# Altium schematic sheet 2_P2.schdoc
size 307 x 218 mm; Symbol: Drawing-Symbol_A4; Device: Drawing-Symbol_A4; @Project Name: ESP32-C3 module_2024-02-14_10-07-03; @Page Count: 2; @Update Date: 2025-09-02; @Create Date: 2025-08-24; @Schematic Name: Schematic1; @Page No: 2; @Page Name: P2; Company: EasyEDA.com; Version: V1.0; Page Size: A4; Drawn: Paraskevas K.; @Create Time: 19:22:43; @Update Time: 13:49:49; Width: 1170; Height: 825; Region Start: 1; X Region Count: 6; Y Region Count: 4; Blade Width: 10; Title Block Position: 3; @Board Name: Sprig-C6
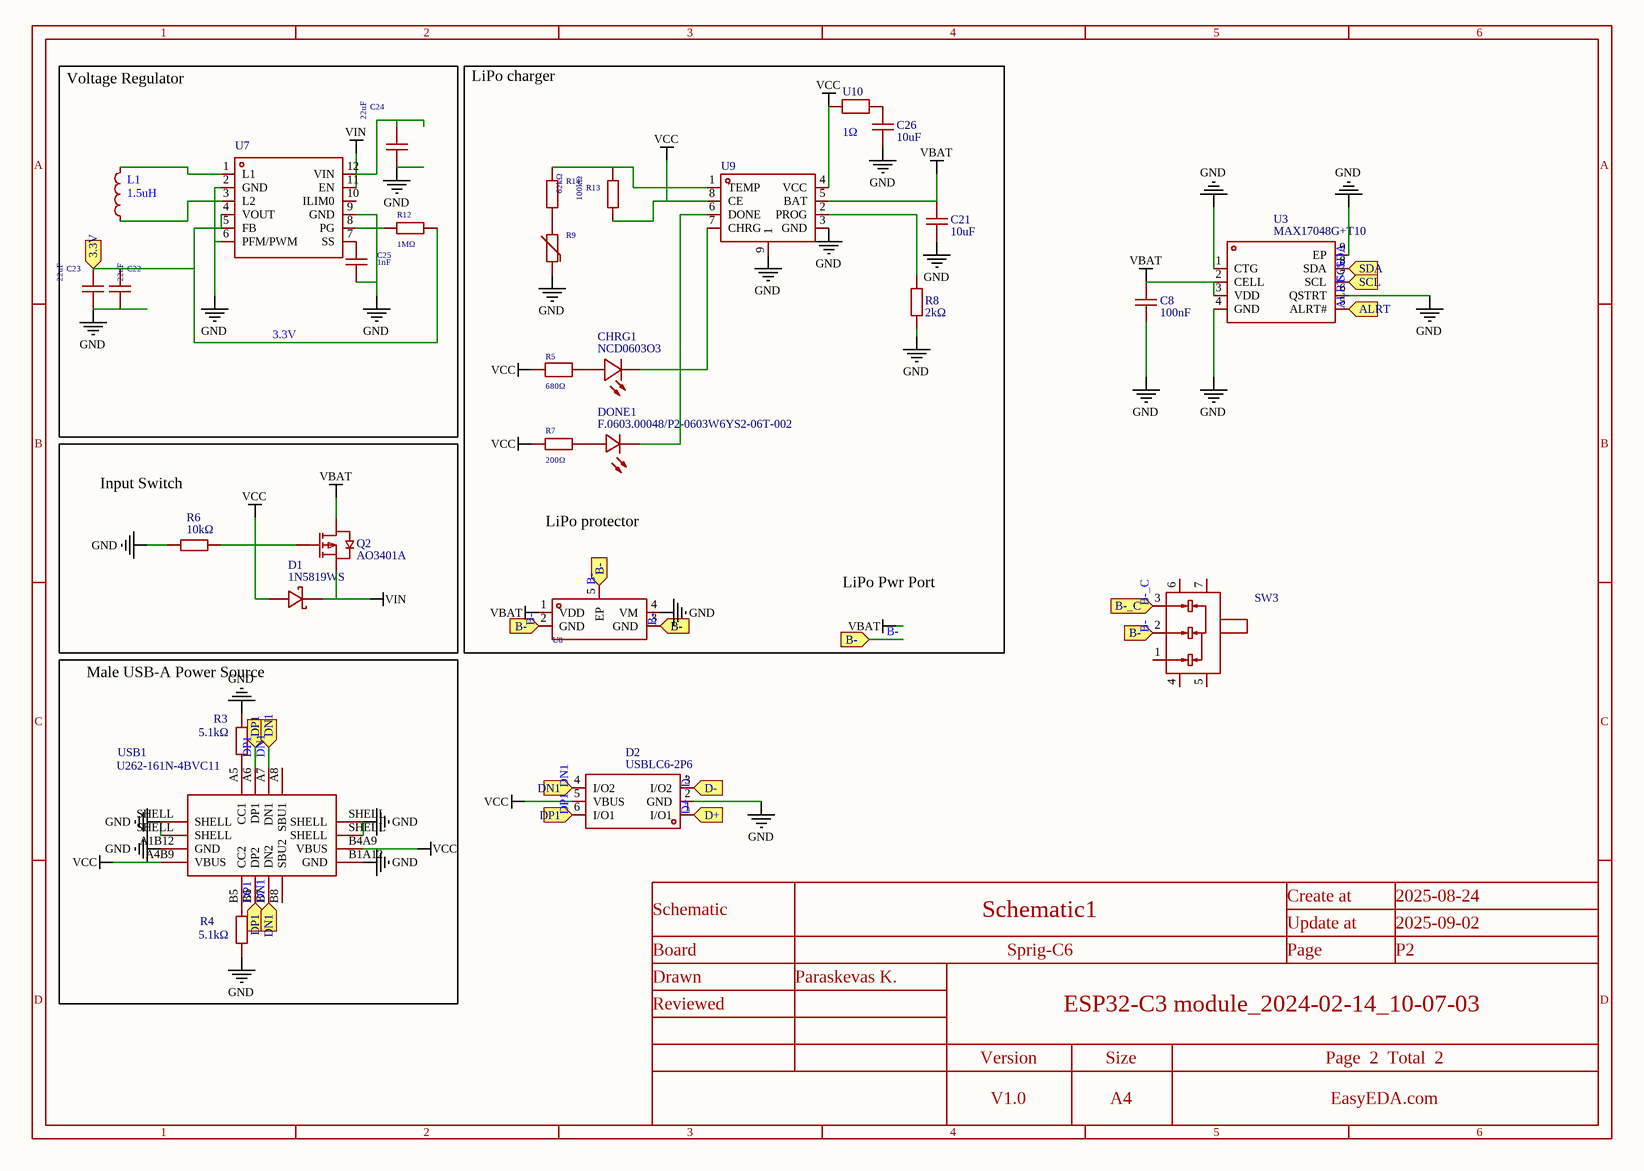
[diagram p0: 2_P2.schdoc]

## Parts
C8  100nF  [C0402]
C21  10uF  [C0402]
C22  22uF  [C0402]
C23  22uF  [C0402]
C24  22uF  [C0402]
C25  1nF  [C0402]
C26  10uF  [C0402]
CHRG1  NCD0603O3  [LED0603-RD]
D1  1N5819WS  [SOD-323_L1.8-W1.3-LS2.5-RD]
D2  USBLC6-2P6  [SOT-666-6_L1.6-W1.2-P0.50-LS1.6-BL]
DONE1  F.0603.00048/P2-0603W6YS2-06T-002  [LED-SMD_L1.6-W0.8-RD-WHITE-2]
L1  1.5uH  [L0806]
Q2  AO3401A  [SOT-23_L2.9-W1.3-P1.90-LS2.4-BR]
R3  5.1kΩ  [R0402]
R4  5.1kΩ  [R0402]
R5  680Ω  [R0402]
R6  10kΩ  [R0402]
R7  200Ω  [R0402]
R8  2kΩ  [R0402]
R9  FNTC0805X104F4250FB  [R0805]  (value not drawn)
R12  1MΩ  [R0402]
R13  100kΩ  [R0402]
R14  62kΩ  [R0402]
SW3  MK-12C03-G015  [SW-SMD_MK-12C03-G015]  (value not drawn)
U3  MAX17048G+T10  [DFN-8_L2.0-W2.0-P0.50-BL-EP]
U7  TPS63051RMWR  [QFN-12_L2.5-W2.5-P0.50-TL]  (value not drawn)
U8  AP6683  [DFN-4_L1.0-W1.0-P0.65-BL-EP]  (value not drawn)
U9  LGS4056H  [DFN-8_L2.0-W2.0-P0.50-TL-EP1.6]  (value not drawn)
U10  1Ω  [R0402]
USB1  U262-161N-4BVC11  [USB-3.1-SMD_U262-161N-4BVC11]

## Blocks framed on the sheet
Voltage Regulator: C22-C25 L1 R12 U7
Input Switch: D1 Q2 R6
Male USB-A Power Source: R3 R4 USB1

## Ports
3.3V (in), ALRT (in), B- (in), B-_C (in), D+ (in), D- (in), DN1 (in), DP1 (in), SCL (in), SDA (in)

## Nets
GND: C8.1 C21.1 C22.1 C23.1 C24.1 C25.1 C26.1 D2.2(GND) R3.2 R4.1 R6.1 R8.1 R9.1 U3.1(CTG) U3.4(GND) U3.6(QSTRT) U3.9(EP) U7.2(GND) U7.6(PFM/PWM) U7.9(GND) U8.4(VM) U9.3(GND) U9.9(1) USB1.A1B12(GND) USB1.B1A12(GND) USB1.SHELL
VBAT: C8.2 C21.2 Q2.3(D) U3.2(CELL) U3.3(VDD) U8.1(VDD) U9.5(BAT)
VCC: D1.2(+) D2.5(VBUS) Q2.1(G) R5.1 R6.2 R7.1 R13.1 U9.4(VCC) U9.8(CE) U10.1 USB1.A4B9(VBUS) USB1.B4A9(VBUS)
VIN: C24.2 D1.1(-) Q2.2(S) U7.11(EN) U7.12(VIN)
3.3V: C22.2 C23.2 R12.2 U7.4(VOUT) U7.5(FB) ; port 3.3V
ALRT: U3.5(ALRT#) ; port ALRT
B-: SW3.2 U8.2(GND) U8.3(GND) U8.5(EP) ; port B-
B-_C: SW3.3 ; port B-_C
D+: D2.1(I/O1) ; port D+
D-: D2.3(I/O2) ; port D-
DN1: D2.4(I/O2) USB1.A7(DN1) USB1.B7(DN2) ; port DN1
DP1: D2.6(I/O1) USB1.A6(DP1) USB1.B6(DP2) ; port DP1
SCL: U3.7(SCL) ; port SCL
SDA: U3.8(SDA) ; port SDA
NetC25_2: C25.2 U7.7(SS)
NetC26_2: C26.2 U10.2
NetCHRG1_1: CHRG1.1(A) R5.2
NetCHRG1_2: CHRG1.2(K) U9.7(CHRG)
NetDONE1_1: DONE1.1(+) R7.2
NetDONE1_2: DONE1.2(-) U9.6(DONE)
NetL1_1: L1.1 U7.3(L2)
NetL1_2: L1.2 U7.1(L1)
NetR3_1: R3.1 USB1.A5(CC1)
NetR4_2: R4.2 USB1.B5(CC2)
NetR8_2: R8.2 U9.2(PROG)
NetR9_2: R9.2 R14.1
NetR12_1: R12.1 U7.8(PG)
NetR13_2: R13.2 R14.2 U9.1(TEMP)

Not connected (* = marked no-connect by the designer): SW3 1 4 5 6 7; U7 10(ILIM0); USB1 A8(SBU1) B8(SBU2)

## Notes on the sheet
- LiPo charger
- LiPo protector
- LiPo Pwr Port
- 1
- 2
- 3
- 4
- 5
- 6
- A
- B
- C
- Schematic
- Schematic1
- Create at
- Update at
- 2025-08-24
- 2025-09-02
- Board
- Drawn
- Paraskevas K.
- Sprig-C6
- Page
- P2
- D
- Reviewed
- Version
- Size
- ESP32-C3 module_2024-02-14_10-07-03
- Page  2  Total  2
- V1.0
- A4
- EasyEDA.com

## Library data of the parts
C8 = 0402B104K160NT: Manufacturer: FH(风华); Add into BOM: yes; Tolerance: ±10%; Symbol: 100nf; Device: 0402B104K160NT; LCSC Part Name: 100nF ±10% 16V; Supplier Part: C41851; Manufacturer Part: 0402B104K160NT; Supplier Footprint: 0402; JLCPCB Part Class: Extended Part; Datasheet: https://atta.szlcsc.com/upload/public/pdf/source/20200305/C486355_26A10D38EF8C2A5C37091D0039909270.pdf; Supplier: LCSC; Convert to PCB: yes; Value: 100nF; Origin Footprint: C0402
C21 C26 = CL05A106MQ5NUNC: Manufacturer: SAMSUNG(三星); Add into BOM: yes; Tolerance: ±20%; Symbol: 10uf; Device: CL05A106MQ5NUNC; LCSC Part Name: 10uF ±20% 6.3V; Supplier Part: C15525; Manufacturer Part: CL05A106MQ5NUNC; Supplier Footprint: 0402; JLCPCB Part Class: Basic Part; Datasheet: https://atta.szlcsc.com/upload/public/pdf/source/20220823/2B02EE04F8F211D38A52DCB16EB6BEBA.pdf; Supplier: LCSC; Convert to PCB: yes; Value: 10uF; Origin Footprint: C0402
C22-C24 = HGC0402R5226M6R3NTEJ: Manufacturer: Chinocera(华瓷); Symbol: CL05A106MQ5NUNC; Add into BOM: yes; Tolerance: ±20%; Voltage Rating: 6.3V; Temperature Coefficient: X5R; Device: HGC0402R5226M6R3NTEJ; Supplier: LCSC; Manufacturer Part: HGC0402R5226M6R3NTEJ; Value: 22uF; Supplier Part: C7432764; JLCPCB Part Class: Extended Part; LCSC Part Name: 22uF ±20% 6.3V; Supplier Footprint: 0402; Datasheet: https://atta.szlcsc.com/upload/public/pdf/source/20240320/FAC3FEC40A78BC5CCCE96C232A94D860.pdf; Convert to PCB: yes
C25 = CC0402KRX7R9BB102: Manufacturer: YAGEO(国巨); Add into BOM: yes; Tolerance: ±10%; Symbol: CC0402KRX7R9BB102; Device: CC0402KRX7R9BB102; LCSC Part Name: 1nF ±10% 50V; Supplier Part: C106205; Manufacturer Part: CC0402KRX7R9BB102; Supplier Footprint: 0402; JLCPCB Part Class: Extended Part; Datasheet: https://atta.szlcsc.com/upload/public/pdf/source/20181008/C309510_22F155564471FAF6A489F7D68F34234E.pdf; Supplier: LCSC; Convert to PCB: yes; Value: 1nF
CHRG1 = NCD0603O3: Manufacturer: 国星光电; Symbol: mht192csct; Add into BOM: yes; Emitted Color: Orange; Forward Voltage (VF): 1.6V~2.4V; Power Dissipation: 65mW; Forward Current: 25mA; Dominant Wavelength: 601nm~610nm; Peak Wavelength: 610nm; Lens Color: 无色透明透镜; Luminous Intensity: 24mcd~80mcd; Viewing Angle: 140°; Mounting Sytle: Positive post; Origin Footprint: LED0603-R-RD_ORANGE; Device: NCD0603O3; LCSC Part Name: NCD0603O3; Supplier Part: C7429913; Manufacturer Part: NCD0603O3; Supplier Footprint: 0603; JLCPCB Part Class: Extended Part; Datasheet: https://atta.szlcsc.com/upload/public/pdf/source/20230620/6A7C990163D71C49E86FABD0D2A51869.pdf; Supplier: LCSC; Convert to PCB: yes; Operating Temperature: -30℃~+85℃; Color Temperature: -; Diode Configuration: -
D1 = 1N5819WS_C191023: Manufacturer: Hottech(合科泰); Symbol: b5819w_c8598; Add into BOM: yes; Forward Voltage (Vf@If): 600mV@1A; Reverse Voltage (Vr): 40V; Average Rectified Current (Io): 1A; Origin Footprint: SOD-123_L2.7-W1.6-LS3.7-RD-1; Device: 1N5819WS_C191023; LCSC Part Name: 电压:40V 电流:1A; Supplier Part: C191023; Manufacturer Part: 1N5819WS; Supplier Footprint: SOD-323; JLCPCB Part Class: Basic Part; Datasheet: https://atta.szlcsc.com/upload/public/pdf/source/20220428/3CB86FD8D28D653594B4E35F9D5AEFD9.pdf; Supplier: LCSC; Convert to PCB: yes
D2 = USBLC6-2P6: Manufacturer: TECH PUBLIC(台舟); Symbol: usblc6-2p6_c2827693; Add into BOM: yes; Type: ESD; Device: USBLC6-2P6; LCSC Part Name: MSL=3; Supplier Part: C2827693; Manufacturer Part: USBLC6-2P6; Supplier Footprint: SOT-666-6; JLCPCB Part Class: Extended Part; Datasheet: https://atta.szlcsc.com/upload/public/pdf/source/20210810/36353A9194EA9F4E33F8AE18BE051AEA.pdf; Supplier: LCSC; Convert to PCB: yes; Origin Footprint: SOT-666-6_L1.6-W1.2-P0.50-LS1.6-BL
DONE1 = F.0603.00048/P2-0603W6YS2-06T-002: Manufacturer: TUOZHAN(拓展光电); Symbol: e6c0603cway1uda; Add into BOM: yes; Illumination Color: Ice Blue; Viewing Angle: 120°; Device: F.0603.00048/P2-0603W6YS2-06T-002; LCSC Part Name: -; Supplier Part: C7496823; Manufacturer Part: F.0603.00048/P2-0603W6YS2-06T-002; Supplier Footprint: 0603; JLCPCB Part Class: Extended Part; Datasheet: https://item.szlcsc.com/datasheet/F.0603.00048%252FP2-0603W6YS2-06T-002/8563187.html; Supplier: LCSC; Convert to PCB: yes; Lamp Holder Type: -; Voltage - Forward(Vf): -; Power(Watts): -; Forward Current: -; Wavelength - Dominant: -; Peak Wavelength: -; Diode Configuration: -; Lens Color: -; Color Temperature: -; Luminous Intensity: -; Mounting Style: -; Operating Temperature: -40℃~+85℃
L1 = DFE201610E-1R5M=P2: Manufacturer: muRata(村田); Add into BOM: yes; Tolerance: ±20%; Symbol: DFE201610E-1R5M=P2; Device: DFE201610E-1R5M=P2; LCSC Part Name: 1.5uH ±20%; Supplier Part: C668311; Manufacturer Part: DFE201610E-1R5M=P2; Supplier Footprint: 0806; JLCPCB Part Class: Extended Part; Datasheet: https://atta.szlcsc.com/upload/public/pdf/source/20190513/C337891_E8F53E7A275D0CF4365E41AA9943B04D.pdf; Supplier: LCSC; Convert to PCB: yes; Value: 1.5uH; Rated Current: -; Saturation Current (Isat): -; DC Resistance (DCR): -; Ratings: -
Q2 = AO3401A_C15127: Manufacturer: AOS; Add into BOM: yes; Drain Source On Resistance (RDS(on)@Vgs,Id): 44mΩ@10V,4.3A; Gate Threshold Voltage (Vgs(th)@Id): 1.3V@250uA; Total Gate Charge (Qg@Vgs): 12.2nC@4.5V; Input Capacitance (Ciss@Vds): 1.2nF@15V; Origin Footprint: SOT-23_L2.9-W1.3-P0.95-LS2.4-BR; Symbol: ao3401a; Device: AO3401A_C15127; LCSC Part Name: P沟道 耐压:30V 电流:4A; Manufacturer Part: AO3401A; Supplier Footprint: SOT-23; JLCPCB Part Class: Basic Part; Datasheet: https://atta.szlcsc.com/upload/public/pdf/source/20160507/1462613609053.pdf; Supplier: LCSC; Convert to PCB: yes; Operating Temperature: -55℃~+150℃@(Tj); image: //image.lceda.cn/szlcsc/C15127.jpg
R3 R4 = 0402WGJ0512TCE: Manufacturer: UNI-ROYAL(厚声); Add into BOM: yes; Tolerance: ±5%; Temperature Coefficient: ±100ppm/℃; Resistance: 5.1K; Symbol: 5.1kΩ; Device: 0402WGJ0512TCE; LCSC Part Name: 5.1kΩ ±5% 62.5mW 厚膜电阻; Supplier Part: C25941; Manufacturer Part: 0402WGJ0512TCE; Supplier Footprint: 0402; JLCPCB Part Class: Extended Part; Datasheet: https://atta.szlcsc.com/upload/public/pdf/source/20200306/C422600_1E6D84923E4A46A82E41ADD87F860B5C.pdf; Supplier: LCSC; Convert to PCB: yes; Type: Thick Film Resistors; Value: 5.1kΩ; Operating Temperature Range: -55℃~+155℃; Origin Footprint: R0402
R5 = RC-02K681JT: Manufacturer: FH(风华); Add into BOM: yes; Tolerance: ±5%; Temperature Coefficient: ±100ppm/℃; Symbol: RC-02K681JT; Device: RC-02K681JT; LCSC Part Name: 厚膜电阻 680Ω ±5% 62.5mW; Supplier Part: C453746; Manufacturer Part: RC-02K681JT; Supplier Footprint: 0402; JLCPCB Part Class: Extended Part; Datasheet: https://atta.szlcsc.com/upload/public/pdf/source/20140616/1457707091974.pdf; Supplier: LCSC; Convert to PCB: yes; Type: Thick Film Resistors; Value: 680Ω; Operating Temperature Range: -55℃~+155℃
R6 = RMS04FT1002: Manufacturer: 大毅科技; Symbol: 100k; Add into BOM: yes; Tolerance: ±1%; Temperature Coefficient: ±100ppm/℃; Device: RMS04FT1002; LCSC Part Name: 厚膜电阻 10kΩ ±1% 62.5mW; Supplier Part: C208775; Manufacturer Part: RMS04FT1002; Supplier Footprint: 0402; JLCPCB Part Class: Extended Part; Datasheet: https://atta.szlcsc.com/upload/public/pdf/source/20190313/C209057_DB28D2F9A2E1A0AF6BB7AAA99A28D7CC.pdf; Supplier: LCSC; Convert to PCB: yes; Type: Thick Film Resistors; Value: 10kΩ; Operating Temperature Range: -55℃~+155℃; Origin Footprint: R0402
R7 = 0402WGF2000TCE: Manufacturer: UNI-ROYAL(厚声); Add into BOM: yes; Tolerance: ±1%; Temperature Coefficient: ±100ppm/℃; Symbol: 0402WGF2000TCE; Device: 0402WGF2000TCE; Supplier: LCSC; Manufacturer Part: 0402WGF2000TCE; Supplier Part: C25087; Value: 200Ω; JLCPCB Part Class: Basic Part; LCSC Part Name: 200Ω ±1% 62.5mW 厚膜电阻; Supplier Footprint: 0402; Datasheet: https://atta.szlcsc.com/upload/public/pdf/source/20200306/C422600_1E6D84923E4A46A82E41ADD87F860B5C.pdf; Convert to PCB: yes; Type: Thick Film Resistors; Operating Temperature Range: -55℃~+155℃
R8 = 0402WGF2001TCE: Manufacturer: UNI-ROYAL(厚声); Symbol: 2k; Add into BOM: yes; Tolerance: ±1%; Temperature Coefficient: ±100ppm/℃; Device: 0402WGF2001TCE; LCSC Part Name: 2kΩ ±1% 62.5mW 厚膜电阻; Supplier Part: C4109; Manufacturer Part: 0402WGF2001TCE; Supplier Footprint: 0402; JLCPCB Part Class: Basic Part; Datasheet: https://atta.szlcsc.com/upload/public/pdf/source/20200306/C422600_1E6D84923E4A46A82E41ADD87F860B5C.pdf; Supplier: LCSC; Convert to PCB: yes; Type: Thick Film Resistors; Value: 2kΩ; Operating Temperature Range: -55℃~+155℃; Origin Footprint: R0402
R9 = FNTC0805X104F4250FB: Manufacturer: cjiang(长江微电); Symbol: NCP15WF104F03RC; Value: NTCThermistor; Add into BOM: yes; Device: FNTC0805X104F4250FB; Supplier: LCSC; Manufacturer Part: FNTC0805X104F4250FB; Supplier Part: C41417469; LCSC Part Name: FNTC0805X104F4250FB; Supplier Footprint: 0805; Datasheet: https://atta.szlcsc.com/upload/public/pdf/source/20240927/680ED90FE3621BD417EAE7BF117A336D.pdf; Convert to PCB: yes; Operating Temperature: -40℃~+125℃
R12 = 0402WGF1004TCE: Manufacturer: UNI-ROYAL(厚声); Add into BOM: yes; Tolerance: ±1%; Temperature Coefficient: ±100ppm/℃; Symbol: 0402WGF1004TCE; Device: 0402WGF1004TCE; Supplier: LCSC; Manufacturer Part: 0402WGF1004TCE; Supplier Part: C26083; Value: 1MΩ; JLCPCB Part Class: Basic Part; LCSC Part Name: 1MΩ ±1% 62.5mW 厚膜电阻; Supplier Footprint: 0402; Datasheet: https://atta.szlcsc.com/upload/public/pdf/source/20200306/C422600_1E6D84923E4A46A82E41ADD87F860B5C.pdf; Convert to PCB: yes; Type: Thick Film Resistors; Operating Temperature Range: -55℃~+155℃
R13 = 0402WGF1003TCE: Manufacturer: UNI-ROYAL(厚声); Add into BOM: yes; Tolerance: ±1%; Temperature Coefficient: ±100ppm/℃; Symbol: 0402WGF1003TCE; Device: 0402WGF1003TCE; Supplier: LCSC; Manufacturer Part: 0402WGF1003TCE; Supplier Part: C25741; Value: 100kΩ; JLCPCB Part Class: Basic Part; LCSC Part Name: 100kΩ ±1% 62.5mW 厚膜电阻; Supplier Footprint: 0402; Datasheet: https://atta.szlcsc.com/upload/public/pdf/source/20200306/C422600_1E6D84923E4A46A82E41ADD87F860B5C.pdf; Convert to PCB: yes; Type: Thick Film Resistors; Operating Temperature Range: -55℃~+155℃
R14 = ERJ2RKF6202X: Manufacturer: PANASONIC(松下); Add into BOM: yes; Tolerance: ±1%; Temperature Coefficient: ±100ppm/℃; Symbol: ERJ2RKF6202X; Device: ERJ2RKF6202X; Supplier: LCSC; Supplier Part: C77604; Manufacturer Part: ERJ2RKF6202X; Value: 62kΩ; JLCPCB Part Class: Extended Part; LCSC Part Name: 62kΩ ±1% 100mW 厚膜电阻; Supplier Footprint: 0402; Datasheet: https://atta.szlcsc.com/upload/public/pdf/source/20190222/C77604_215DF19229BE9E910CAA70C582100C6C.pdf; Convert to PCB: yes; Type: Thick Film Resistors; Overload Voltage (Max): -; Operating Temperature Range: -55℃~+155℃
SW3 = MK-12C03-G015: Manufacturer: G-Switch(品赞); Add into BOM: yes; Circuit: SPDT; Actuator Style: Rectangular columnar; Pin Style: SMDSplicing; Switch Length: 6.65mm; Switch Width: 2.75mm; Switch Height: 4.25mm; Actuator Color: White; Current Rating (DC): 1A; Voltage Rating (DC): 6V; Mechanical Life: 1万次; Symbol: MK-12C03-G015; Device: MK-12C03-G015; LCSC Part Name: 新七脚小拨动开关 G1.5mm; Supplier Part: C2890358; Manufacturer Part: MK-12C03-G015; Supplier Footprint: SMD; JLCPCB Part Class: Extended Part; Datasheet: https://atta.szlcsc.com/upload/public/pdf/source/20240612/7D979AF25627BA0CE326E7EBF8EC90FA.pdf; Supplier: LCSC; Convert to PCB: yes; Mounting Style: 卧贴; Operating Temperature: -20℃~+70℃
U3 = MAX17048G+T10: Manufacturer: ADI(亚德诺)/MAXIM(美信); Add into BOM: yes; The Chip Type: 电池监测芯片; Type of Battery: 锂离子/Polymer; Number of Cells: 1; Symbol: max17048g+t10; Device: MAX17048G+T10; LCSC Part Name: MAX17048G+T10; Supplier Part: C2682616; Manufacturer Part: MAX17048G+T10; Supplier Footprint: DFN-8-EP(2x2); JLCPCB Part Class: Extended Part; Datasheet: https://atta.szlcsc.com/upload/public/pdf/source/20210106/C2682616_818568B5D3BA4B627110FCAA33E0BFB1.pdf; Supplier: LCSC; Convert to PCB: yes; Operating Temperature: -20℃~+70℃; Origin Footprint: DFN-8_L2.0-W2.0-P0.50-BL-EP; link: https://lcsc.com/eda_search?q=C2682616&amp;%26type=1&amp;ref=editor
U7 = TPS63051RMWR: Manufacturer: TI(德州仪器); Add into BOM: yes; Function: Buck-boost type; Output Type: Fixed; Input Voltage: 2.5V~5.5V; Output Voltage: 3.3V; Output Current (Max): 500mA; Switching Frequency: 2.5MHz; Number of Outputs: 1; Topology: Step-down-Boost; Switch tube (built-in/external): 内置; Symbol: TPS63051RMWR; Device: TPS63051RMWR; LCSC Part Name: TPS63051RMWR; Supplier Part: C139412; Manufacturer Part: TPS63051RMWR; Supplier Footprint: QFN-12(2.5x2.5); JLCPCB Part Class: Extended Part; Datasheet: https://www.ti.com/cn/lit/gpn/tps63051; Supplier: LCSC; Convert to PCB: yes; Operating Temperature: -40℃~+85℃@(TA); Synchronous Rectification: Yes
U8 = AP6683: Manufacturer: ALLPOWER(铨力); Add into BOM: yes; Symbol: AP6683; Device: AP6683; Supplier: LCSC; Supplier Part: C2849565; Manufacturer Part: AP6683; JLCPCB Part Class: Extended Part; LCSC Part Name: AP6683; Supplier Footprint: DFN-4-EP(1x1); Datasheet: https://atta.szlcsc.com/upload/public/pdf/source/20210723/C2849565_EA604836CC73D2108C5387801D1EBC6A.pdf; Convert to PCB: yes
U9 = LGS4056H: Manufacturer: Legend-Si(棱晶半导体); Add into BOM: yes; The Chip Type: 线性充电芯片; Supply Voltage: 4V~6V; Maximum Charge Current: 1A; Charging Saturation Voltage: 4.2V; Type of Battery: 锂离子/Polymer; Number of Cells: 1; Symbol: LGS4056H; Device: LGS4056H; LCSC Part Name: TP4056H(DFN); Supplier Part: C5124109; Manufacturer Part: LGS4056H; Supplier Footprint: DFN-8(2x2); JLCPCB Part Class: Extended Part; Datasheet: https://atta.szlcsc.com/upload/public/pdf/source/20230407/EF281A5928E4D64337F5505487E44644.pdf; Supplier: LCSC; Convert to PCB: yes; Operating Temperature: -40℃~+125℃
U10 = FRC0402F1R00TS: Manufacturer: FOJAN(富捷); Add into BOM: yes; Tolerance: ±1%; Temperature Coefficient: ±200ppm/℃; Symbol: FRC0402F1R00TS; Device: FRC0402F1R00TS; LCSC Part Name: 1Ω ±1% 62.5mW 厚膜电阻; Supplier Part: C2909329; Manufacturer Part: FRC0402F1R00TS; Supplier Footprint: 0402; JLCPCB Part Class: Extended Part; Datasheet: https://atta.szlcsc.com/upload/public/pdf/source/20211221/925EC7D7225764EE0046F22065062C87.pdf; Supplier: LCSC; Convert to PCB: yes; Type: Thick Film Resistors; Value: 1Ω; Operating Temperature Range: -55℃~+155℃
USB1 = U262-161N-4BVC11: Manufacturer: XKB Connectivity(中国星坤); Symbol: u262-16xn-4bvc11; Add into BOM: yes; Connector Type: Type-C; Gender: Female; Number of Ports: 1; Number of Contacts: 16P; Current Rating - Power (Max): 3A; Soldering Temperature(Max): 260℃; Device: U262-161N-4BVC11; LCSC Part Name: Type-C 母 卧贴; Supplier Part: C319148; Manufacturer Part: U262-161N-4BVC11; Supplier Footprint: SMD; JLCPCB Part Class: Extended Part; Datasheet: https://atta.szlcsc.com/upload/public/pdf/source/20211015/B478CBA0F1623DA36A6CC6918C49C838.pdf; Supplier: LCSC; Convert to PCB: yes; Standard: USB 3.1; Mounting Style: 卧贴; Contact Material: Copper Alloy; Contact Plating: Gold; Operating Temperature Range: -40℃~+85℃; Origin Footprint: USB-3.1-SMD_U262-161N-4BVC11